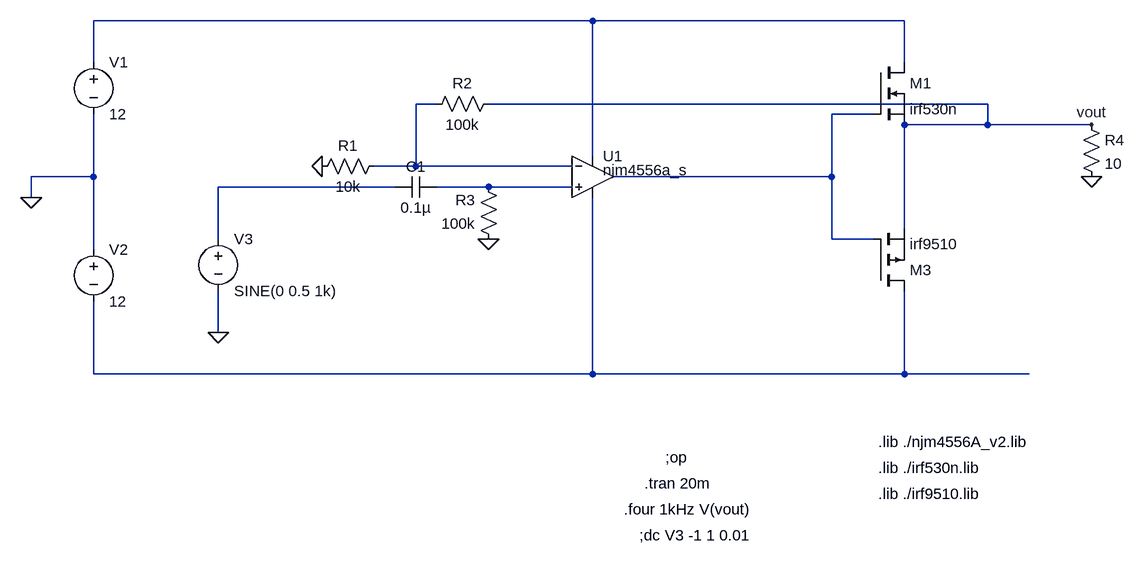
[diagram p0: schematic prelab4.asc]
prelab4.asc, the LTspice schematic file:
Version 4
SHEET 1 1320 808
WIRE 160 0 -608 0
WIRE 640 0 160 0
WIRE -608 64 -608 0
WIRE 640 64 640 0
WIRE -80 128 -112 128
WIRE 768 128 0 128
WIRE 592 144 528 144
WIRE 768 160 768 128
WIRE 768 160 640 160
WIRE 928 160 768 160
WIRE 160 208 160 0
WIRE -112 224 -112 128
WIRE -112 224 -176 224
WIRE 128 224 -112 224
WIRE -608 240 -608 144
WIRE -608 240 -704 240
WIRE 528 240 192 240
WIRE 528 240 528 144
WIRE -144 256 -416 256
WIRE 0 256 -80 256
WIRE 128 256 0 256
WIRE -704 272 -704 240
WIRE 640 320 640 160
WIRE -416 336 -416 256
WIRE 528 336 528 240
WIRE 592 336 528 336
WIRE -608 352 -608 240
WIRE -416 480 -416 416
WIRE -608 544 -608 432
WIRE 160 544 160 272
WIRE 160 544 -608 544
WIRE 640 544 640 416
WIRE 640 544 160 544
WIRE 832 544 640 544
FLAG -704 272 0
FLAG -416 480 0
FLAG -256 224 0
FLAG 0 336 0
FLAG 928 160 vout
FLAG 928 240 0
SYMBOL opamp2 160 176 R0
WINDOW 3 16 96 Invisible 2
WINDOW 38 16 54 Left 2
SYMATTR Value ""
SYMATTR SpiceModel njm4556a_s
SYMATTR InstName U1
SYMBOL voltage -608 48 R0
WINDOW 123 0 0 Left 2
WINDOW 39 0 0 Left 2
SYMATTR InstName V1
SYMATTR Value 12
SYMBOL voltage -608 336 R0
WINDOW 123 0 0 Left 2
WINDOW 39 0 0 Left 2
SYMATTR InstName V2
SYMATTR Value 12
SYMBOL pmos 592 416 M180
SYMATTR InstName M3
SYMATTR Value irf9510
SYMATTR Prefix X
SYMBOL nmos 592 64 R0
SYMATTR InstName M1
SYMATTR Value irf530n
SYMATTR Prefix X
SYMBOL voltage -416 320 R0
WINDOW 123 24 44 Left 2
WINDOW 39 0 0 Left 2
SYMATTR InstName V3
SYMATTR Value SINE(0 0.5 1k)
SYMBOL Res -160 208 R90
WINDOW 0 0 56 VBottom 2
WINDOW 3 32 56 VTop 2
SYMATTR InstName R1
SYMATTR Value 10k
SYMBOL Res 16 112 R90
WINDOW 0 0 56 VBottom 2
WINDOW 3 32 56 VTop 2
SYMATTR InstName R2
SYMATTR Value 100k
SYMBOL Res 16 352 R180
WINDOW 0 36 76 Left 2
WINDOW 3 36 40 Left 2
SYMATTR InstName R3
SYMATTR Value 100k
SYMBOL Cap -80 240 R90
WINDOW 0 0 32 VBottom 2
WINDOW 3 32 32 VTop 2
SYMATTR InstName C1
SYMATTR Value 0.1µ
SYMBOL Res 912 144 R0
SYMATTR InstName R4
SYMATTR Value 10
TEXT 600 728 Left 2 !.lib ./irf9510.lib
TEXT 600 648 Left 2 !.lib ./njm4556A_v2.lib
TEXT 240 712 Left 2 !.tran 20m
TEXT 272 672 Left 2 !;op
TEXT 208 752 Left 2 !.four 1kHz V(vout)
TEXT 232 792 Left 2 !;dc V3 -1 1 0.01
TEXT 600 688 Left 2 !.lib ./irf530n.lib

The netlist it stands for:
* prelab4.asc
XU1 N005 N002 N001 N006 N003 njm4556a_s  ; pins In+ In- V+ V- OUT
V1 N001 0 12
V2 0 N006 12
XM3 N006 N003 vout irf9510  ; pins D G S
XM1 N001 N003 vout irf530n  ; pins D G S
V3 N004 0 SINE(0 0.5 1k)
R1 N002 0 10k
R2 vout N002 100k
R3 0 N005 100k
C1 N005 N004 0.1µ
R4 vout 0 10
.lib ./irf9510.lib
.lib ./njm4556A_v2.lib
.tran 20m
;op
.four 1kHz V(vout)
;dc V3 -1 1 0.01
.lib ./irf530n.lib
.backanno
.end